# EAGLE schematic OUT_16HP_bpb (EAGLE 6.6.0)
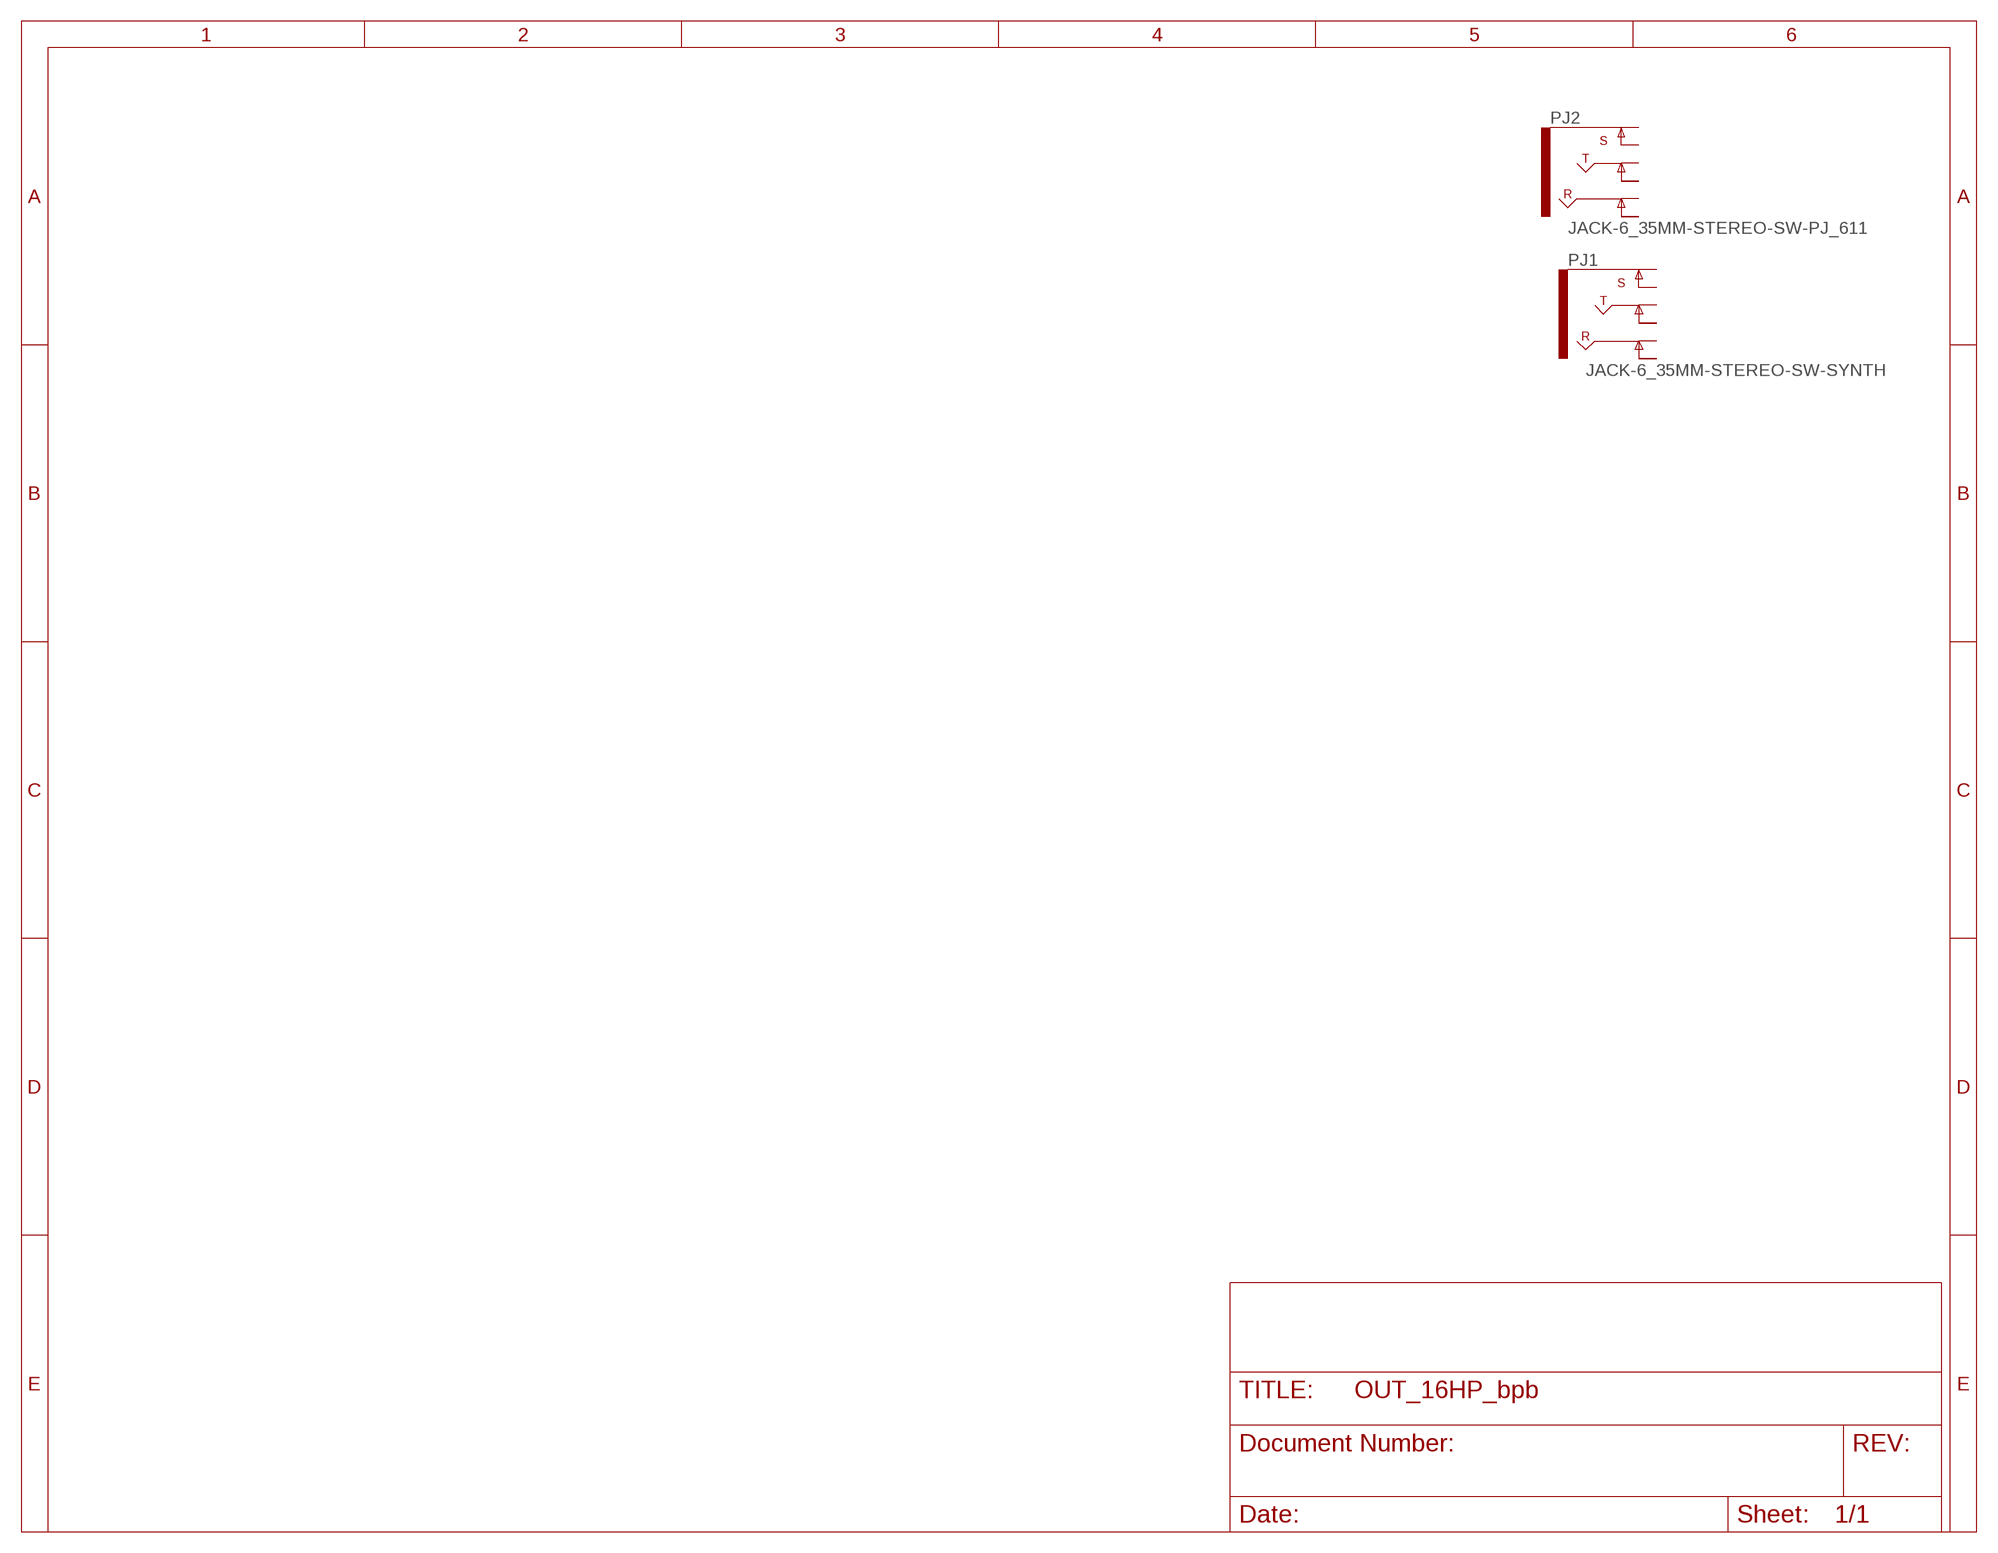
[diagram p0: schematic, sheet 1]

## Parts
PJ1  JACK-6_35MM-STEREO-SW-SYNTH  [PJ-6_35MM-PTH-STEREO-SW]
PJ2  JACK-6_35MM-STEREO-SW-PJ_611  [PJ-611]
Unconnected: PJ1.RING PJ1.RING-SW PJ1.SLEEVE PJ1.SLEEVE-SW PJ1.TIP PJ1.TIP-SW PJ2.RING PJ2.RING-SW PJ2.SLEEVE PJ2.SLEEVE-SW PJ2.TIP PJ2.TIP-SW

## Library data of the parts
PJ1 PJ2 = halcyonmod_Connectors:JACK-6_35MM-STEREO-SW: Tip-Ring-Sleeve Jack, 1/4" , Right Angle, with switches